# Altium schematic sheet LinPOL12.SchDoc: LinPOL12
size A portrait; DocumentNumber: 16; SheetNumber: 16; SheetTotal: 22
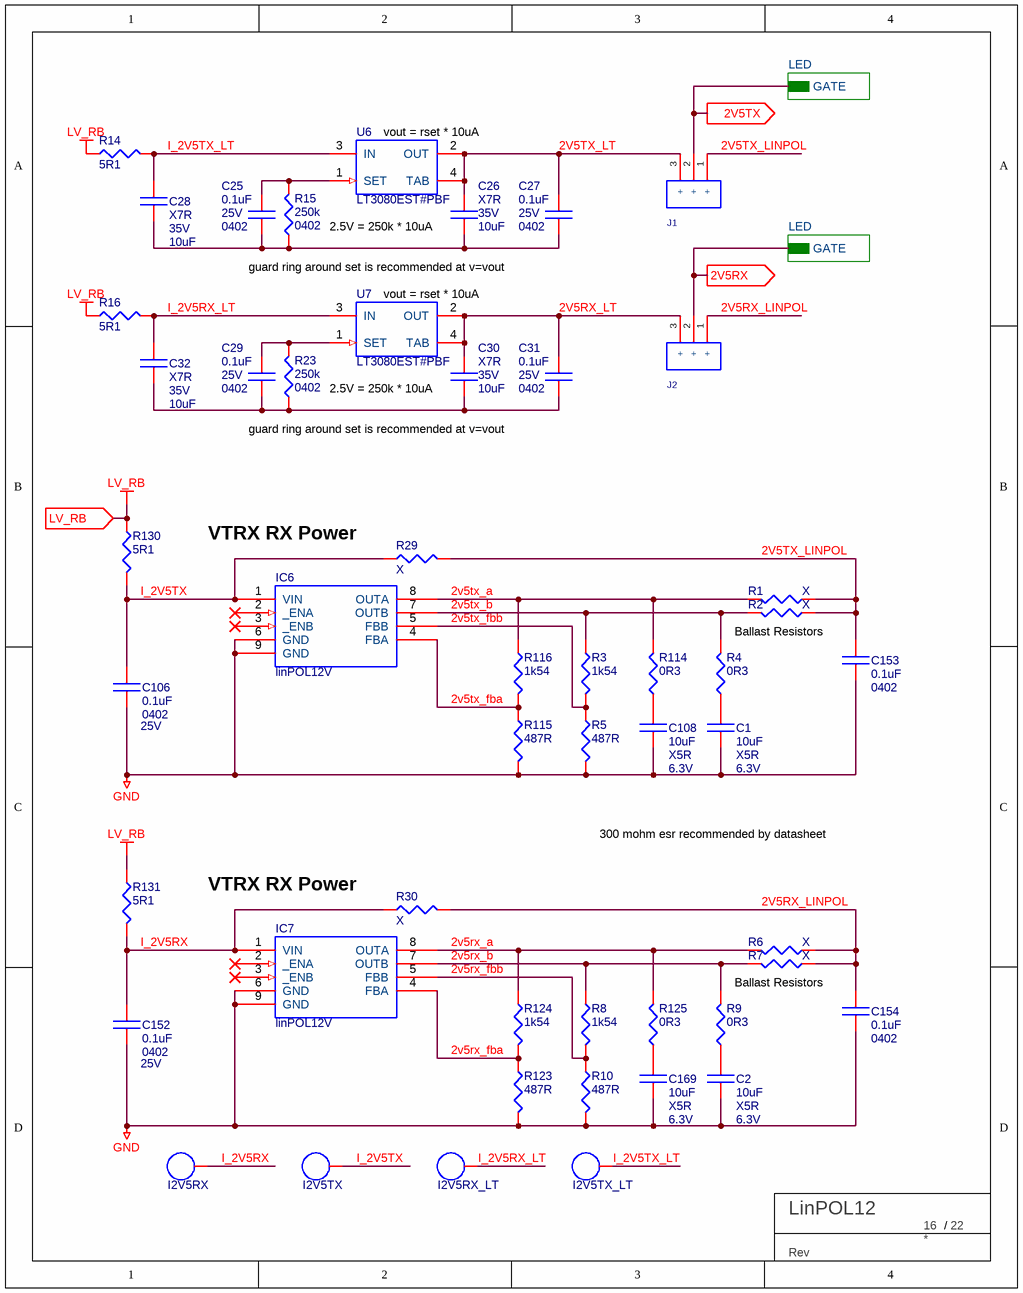
[diagram p0: LinPOL12.SchDoc]

## Parts
C1  TempCo: X5R  Voltage: 6.3V  [C_0603_IPC]  (hidden comment: 10uF)
C2  TempCo: X5R  Voltage: 6.3V  [C_0603_IPC]  (hidden comment: 10uF)
C25  0.1uF  Voltage: 25V  Package: 0402  [C_0402_IPC_NOSILK]
C26  TempCo: X7R  Voltage: 35V  [C_1206_IPC]  (hidden comment: 10uF)
C27  0.1uF  Voltage: 25V  Package: 0402  [C_0402_IPC_NOSILK]
C28  TempCo: X7R  Voltage: 35V  [C_1206_IPC]  (hidden comment: 10uF)
C29  0.1uF  Voltage: 25V  Package: 0402  [C_0402_IPC_NOSILK]
C30  TempCo: X7R  Voltage: 35V  [C_1206_IPC]  (hidden comment: 10uF)
C31  0.1uF  Voltage: 25V  Package: 0402  [C_0402_IPC_NOSILK]
C32  TempCo: X7R  Voltage: 35V  [C_1206_IPC]  (hidden comment: 10uF)
C106  0.1uF  Voltage: 25V  Package: 0402  [C_0402_IPC_NOSILK]
C108  TempCo: X5R  Voltage: 6.3V  [C_0603_IPC]  (hidden comment: 10uF)
C152  0.1uF  Voltage: 25V  Package: 0402  [C_0402_IPC_NOSILK]
C153  0.1uF  Package: 0402  [C_0402_IPC_NOSILK]
C154  0.1uF  Package: 0402  [C_0402_IPC_NOSILK]
C169  TempCo: X5R  Voltage: 6.3V  [C_0603_IPC]  (hidden comment: 10uF)
IC6  linPOL12V  [WDFNX208]
IC7  linPOL12V  [WDFNX208]
J1  HEADER 01x03  [HEADER 01x03]  (value not drawn)
J2  HEADER 01x03  [HEADER 01x03]  (value not drawn)
R1  X  [R_0402_IPC]
R2  X  [R_0402_IPC]
R3  1k54  [R_0402_IPC]
R4  0R3  [R_0402_IPC]
R5  487R  [R_0402_IPC]
R6  X  [R_0402_IPC]
R7  X  [R_0402_IPC]
R8  1k54  [R_0402_IPC]
R9  0R3  [R_0402_IPC]
R10  487R  [R_0402_IPC]
R14  5R1  [R_0402_IPC]
R15  250k  Footprint: 0402  [R_0402_IPC]
R16  5R1  [R_0402_IPC]
R23  250k  Footprint: 0402  [R_0402_IPC]
R29  Parameter 1: X  [resc1005n]  (hidden comment: ERJ-2GEJ201X)
R30  Parameter 1: X  [resc1005n]  (hidden comment: ERJ-2GEJ201X)
R114  0R3  [R_0402_IPC]
R115  487R  [R_0402_IPC]
R116  1k54  [R_0402_IPC]
R123  487R  [R_0402_IPC]
R124  1k54  [R_0402_IPC]
R125  0R3  [R_0402_IPC]
R130  5R1  [R_0402_IPC]
R131  5R1  [R_0402_IPC]
TBLOCK?  BU Title block  (value not drawn)  (graphical)
TP3  I2V5RX_LT  [testpoint]  (no BOM)
TP4  I2V5TX_LT  [testpoint]  (no BOM)
TP16  I2V5RX  [testpoint]  (no BOM)
TP17  I2V5TX  [testpoint]  (no BOM)
U6  LT3080EST#PBF  [LT-ST-3-SOT-223_N]
U7  LT3080EST#PBF  [LT-ST-3-SOT-223_N]

## Sub-sheets
LED = LED-Driver.SchDoc: GATE
LED = LED-Driver.SchDoc: GATE

## Ports
2V5RX (out), 2V5TX (out), LV_RB (in)

## Nets
GND: C1.2 C2.2 C106.2 C108.2 C152.2 C153.2 C154.2 C169.2 IC6.6(GND) IC6.9(GND) IC7.6(GND) IC7.9(GND) R5.2 R10.2 R115.2 R123.2
LV_RB: R14.1 R16.1 R130.1 R131.1 ; port LV_RB
2V5RX: J2.2(+) ; port 2V5RX, sheet LED/GATE
2v5rx_a: IC7.8(OUTA) R6.2 R124.1 R125.2
2v5rx_b: IC7.7(OUTB) R7.2 R8.1 R9.2
2v5rx_fba: IC7.4(FBA) R123.1 R124.2
2v5rx_fbb: IC7.5(FBB) R8.2 R10.1
2V5RX_LINPOL: C154.1 J2.1(+) R6.1 R7.1 R30.2
2V5RX_LT: C30.1 C31.1 J2.3(+) U7.2(OUT) U7.4(TAB)
2V5TX: J1.2(+) ; port 2V5TX, sheet LED/GATE
2v5tx_a: IC6.8(OUTA) R1.2 R114.2 R116.1
2v5tx_b: IC6.7(OUTB) R2.2 R3.1 R4.2
2v5tx_fba: IC6.4(FBA) R115.1 R116.2
2v5tx_fbb: IC6.5(FBB) R3.2 R5.1
2V5TX_LINPOL: C153.1 J1.1(+) R1.1 R2.1 R29.2
2V5TX_LT: C26.1 C27.1 J1.3(+) U6.2(OUT) U6.4(TAB)
I_2V5RX: C152.1 IC7.1(VIN) R30.1 R131.2 TP16.1(TP)
I_2V5RX_LT: C32.1 R16.2 TP3.1(TP) U7.3(IN)
I_2V5TX: C106.1 IC6.1(VIN) R29.1 R130.2 TP17.1(TP)
I_2V5TX_LT: C28.1 R14.2 TP4.1(TP) U6.3(IN)
NetC1_1: C1.1 R4.1
NetC2_1: C2.1 R9.1
NetC25_1: C25.1 R15.2 U6.1(SET)
NetC25_2: C25.2 C26.2 C27.2 C28.2 R15.1
NetC29_1: C29.1 R23.2 U7.1(SET)
NetC29_2: C29.2 C30.2 C31.2 C32.2 R23.1
NetC108_1: C108.1 R114.1
NetC169_1: C169.1 R125.1

Not connected (* = marked no-connect by the designer): IC6 2(_ENA)* 3(_ENB)*; IC7 2(_ENA)* 3(_ENB)*

## Notes on the sheet
- (near U6) vout = rset * 10uA
- 2.5V = 250k * 10uA
- guard ring around set is recommended at v=vout
- (near U7) vout = rset * 10uA
- VTRX RX Power
- Ballast Resistors
- 300 mohm esr recommended by datasheet
- (in symbol TITLE_BLOCK_BU) /; Rev

## Library data of the parts
C1 C2 C108 C169 = C-CER-E6-10uF-0603-6.3V-X5R: GRM185R60J106ME15J; VALUE: 10uF
C25 C27 C29 C31 C106 C152 = C-CER-E5-0.1uF-0402-25V-X7R: GRM155R71E104ME14D; TempCo: X7R
C26 C28 C30 C32 = C-CER-E6-10uF-1206-35V-X7R: CAP CER 10UF 35V X7R 1206; Supplier 1: Digi-Key; VALUE: 10uF; Supplier Part Number 1: 587-3007-1-ND
C153 C154 = C-CER-E5-0.1uF-0402-25V-X7R: GRM155R71E104ME14D; Voltage: 25V; TempCo: X7R
J1 J2 = HEADER 01x03: Header, 01x03, 100 mil, PTH
R1 R2 R4 R6 R7 R9 R114 R125 = R-E0-0R3-0402-5%: RES 0.3 OHM 5% 1/6W 0402; Part Number: RR0510P-102-D
R3 R8 R116 R124 = R-E3-1K54-0402-0.5%: RES SMD 1.54K OHM 0.5% 1/16W 0402; Part Number: RR0510P-1541-D
R5 R10 R115 R123 = R-E2-487R-0402-0.5%: RES SMD 487 OHM 0.5% 1/16W 0402; Part Number: RR0510P-4870-D
R14 R16 R130 R131 = R-E0-5R1-0402-5%: RES SMD 5.1 OHM 5% 1/10W 0402
R15 R23 = R-E5-250k0-0402-1%: RES SMD 250K OHM 1% 1/16W 0402
R29 R30 = R1: FILM RESISTOR; Text Field2: 5%
TBLOCK? = TITLE_BLOCK_BU
TP3 TP4 TP16 TP17 = TP: TEST POINT 40MIL DIA.
U6 U7 = LT3080EST#PBF: Adjustable 1.1 A Single Resistor Low Dropout Regulator, 0.3 mA Isupply, 3-pin SOT223 (ST-3), -40 to 125 degC, Pb-Free; Manufacturer: Linear Technology; Manufacturer 1: Analog Devices / Linear Technology; Initial Accuracy(%): 1; Vin Max(V): 36; Vin Min(V): 1.2; Extended Temp: E, I; Isupply(mA): 0.3; Mounting Technology: Surface Mount; DatasheetVersion: Rev. F; ComponentLink1URL: http://www.linear.com/; PartNumber: LT3080EST#PBF; ComponentLink2Description: Datasheet; ComponentLink3URL: http://cds.linear.com/docs/en/packaging/SOT_3_05-08-1630.pdf; PackageDescription: 3-Pin Plastic SOT-223, Body 3.505 x 6.505 mm, Pitch 2.3 mm; PackageVersion: Jun-10; ComponentLink2URL: http://cds.linear.com/docs/en/datasheet/3080fc.pdf; RoHS: TRUE; ComponentLink3Description: Package Specification; PackageReference: ST-3; ComponentLink1Description: Manufacturer URL; Manufacturer Part Number 1: LT3080EST#PBF